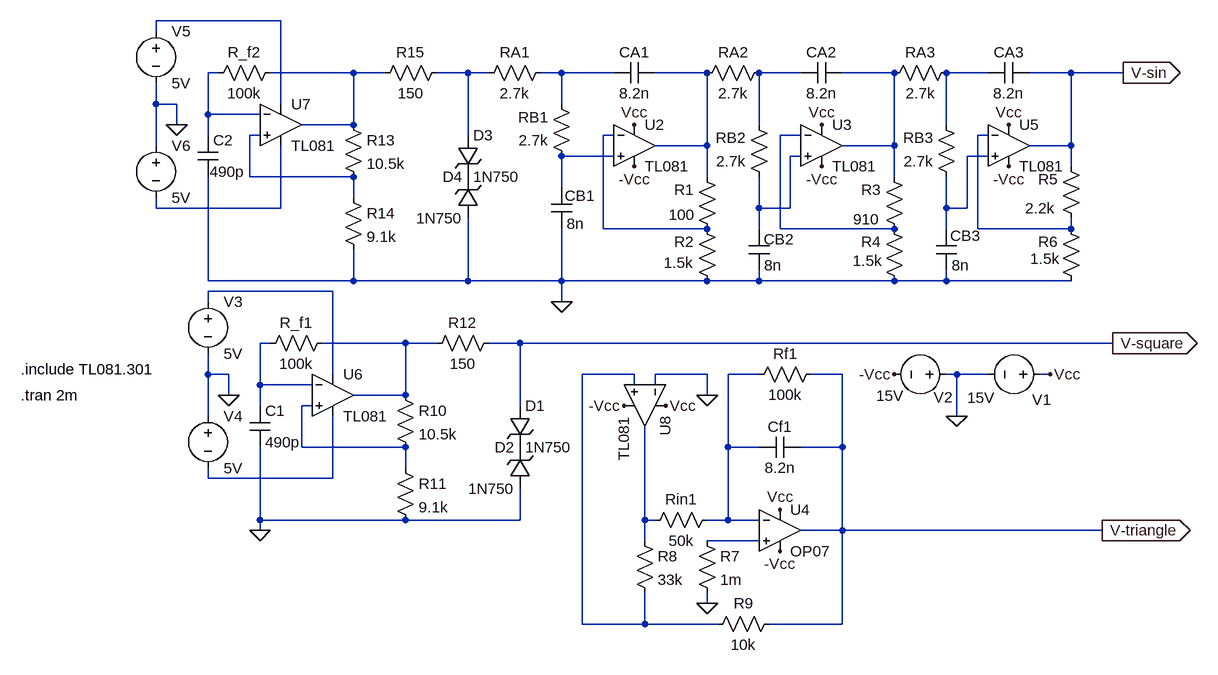
[diagram p0: schematic full circuit.asc]
full circuit.asc, the LTspice schematic file:
Version 4
SHEET 1 1568 840
WIRE -48 -288 -240 -288
WIRE -240 -272 -240 -288
WIRE -144 -208 -160 -208
WIRE 64 -208 -64 -208
WIRE 112 -208 64 -208
WIRE 240 -208 192 -208
WIRE 272 -208 240 -208
WIRE 384 -208 352 -208
WIRE 464 -208 384 -208
WIRE 608 -208 528 -208
WIRE 752 -208 688 -208
WIRE 896 -208 816 -208
WIRE 1040 -208 976 -208
WIRE 1168 -208 1104 -208
WIRE 1248 -208 1168 -208
WIRE -240 -160 -240 -192
WIRE -208 -160 -240 -160
WIRE -48 -160 -48 -288
WIRE 384 -160 384 -208
WIRE -160 -144 -160 -208
WIRE -80 -144 -160 -144
WIRE -208 -128 -208 -160
WIRE 64 -128 64 -208
WIRE 64 -128 -16 -128
WIRE 688 -128 688 -208
WIRE 976 -128 976 -208
WIRE -160 -112 -160 -144
WIRE -80 -112 -96 -112
WIRE 240 -112 240 -208
WIRE 464 -112 448 -112
WIRE 752 -112 720 -112
WIRE 1040 -112 1024 -112
WIRE -240 -96 -240 -160
WIRE 608 -96 608 -208
WIRE 608 -96 528 -96
WIRE 896 -96 896 -208
WIRE 896 -96 816 -96
WIRE 1168 -96 1168 -208
WIRE 1168 -96 1104 -96
WIRE 464 -80 384 -80
WIRE 752 -80 736 -80
WIRE 1040 -80 1008 -80
WIRE 1168 -64 1168 -96
WIRE -96 -48 -96 -112
WIRE 64 -48 -96 -48
WIRE 608 -48 608 -96
WIRE 896 -48 896 -96
WIRE 384 -32 384 -80
WIRE 64 -16 64 -48
WIRE -240 0 -240 -16
WIRE -48 0 -48 -96
WIRE -48 0 -240 0
WIRE 688 0 688 -48
WIRE 736 0 736 -80
WIRE 736 0 688 0
WIRE 976 0 976 -48
WIRE 1008 0 1008 -80
WIRE 1008 0 976 0
WIRE 448 32 448 -112
WIRE 608 32 448 32
WIRE 688 32 688 0
WIRE 720 32 720 -112
WIRE 896 32 720 32
WIRE 976 32 976 0
WIRE 1024 32 1024 -112
WIRE 1168 32 1168 16
WIRE 1168 32 1024 32
WIRE -160 112 -160 -48
WIRE 64 112 64 64
WIRE 64 112 -160 112
WIRE 240 112 240 16
WIRE 240 112 64 112
WIRE 384 112 384 32
WIRE 384 112 240 112
WIRE 608 112 384 112
WIRE 688 112 688 96
WIRE 688 112 608 112
WIRE 896 112 688 112
WIRE 976 112 976 96
WIRE 976 112 896 112
WIRE 1168 112 976 112
WIRE 32 128 -160 128
WIRE -160 144 -160 128
WIRE 384 144 384 112
WIRE -64 208 -80 208
WIRE 144 208 16 208
WIRE 192 208 144 208
WIRE 320 208 272 208
WIRE 1232 208 320 208
WIRE -160 256 -160 224
WIRE -128 256 -160 256
WIRE 32 256 32 128
WIRE 496 256 416 256
WIRE 608 256 528 256
WIRE 688 256 640 256
WIRE 816 256 768 256
WIRE 992 256 976 256
WIRE 1040 256 992 256
WIRE 1136 256 1120 256
WIRE -80 272 -80 208
WIRE 0 272 -80 272
WIRE 496 272 496 256
WIRE 528 272 528 256
WIRE -128 288 -128 256
WIRE 144 288 144 208
WIRE 144 288 64 288
WIRE 608 288 608 256
WIRE -80 304 -80 272
WIRE 0 304 -16 304
WIRE 320 304 320 208
WIRE -160 320 -160 256
WIRE 992 320 992 256
WIRE -16 368 -16 304
WIRE 144 368 -16 368
WIRE 640 368 640 256
WIRE 688 368 640 368
WIRE 816 368 816 256
WIRE 816 368 752 368
WIRE 144 400 144 368
WIRE -160 416 -160 400
WIRE 32 416 32 320
WIRE 32 416 -160 416
WIRE -80 480 -80 368
WIRE 144 480 -80 480
WIRE 320 480 320 432
WIRE 320 480 144 480
WIRE 512 480 512 336
WIRE 528 480 512 480
WIRE 640 480 640 368
WIRE 640 480 608 480
WIRE 688 480 640 480
WIRE -80 496 -80 480
WIRE 816 496 816 368
WIRE 816 496 752 496
WIRE 1216 496 816 496
WIRE 512 512 512 480
WIRE 688 512 608 512
WIRE 608 608 608 592
WIRE 416 640 416 256
WIRE 512 640 512 592
WIRE 512 640 416 640
WIRE 624 640 512 640
WIRE 816 640 816 496
WIRE 816 640 704 640
FLAG 1136 256 Vcc
FLAG 896 256 -Vcc
FLAG 496 -64 -Vcc
FLAG 784 -64 -Vcc
FLAG 1072 -64 -Vcc
FLAG 496 -128 Vcc
FLAG 784 -128 Vcc
FLAG 1072 -128 Vcc
FLAG 992 320 0
FLAG 608 608 0
FLAG 720 464 Vcc
FLAG 720 528 -Vcc
FLAG 544 304 Vcc
FLAG 480 304 -Vcc
FLAG 608 288 0
FLAG -80 496 0
FLAG -128 288 0
FLAG 1248 -208 V-sin
IOPIN 1248 -208 Out
FLAG 1232 208 V-square
IOPIN 1232 208 Out
FLAG 1216 496 V-triangle
IOPIN 1216 496 Out
FLAG -208 -128 0
FLAG 384 144 0
SYMBOL voltage 1136 256 R90
WINDOW 123 0 0 Left 0
WINDOW 39 0 0 Left 0
WINDOW 0 39 -1 VRight 2
WINDOW 3 36 85 VRight 2
SYMATTR InstName V1
SYMATTR Value 15V
SYMBOL voltage 992 256 R90
WINDOW 123 0 0 Left 0
WINDOW 39 0 0 Left 0
WINDOW 0 35 6 VRight 2
WINDOW 3 33 81 VRight 2
SYMATTR InstName V2
SYMATTR Value 15V
SYMBOL res 400 -64 R180
WINDOW 0 36 76 Left 2
WINDOW 3 36 40 Left 2
SYMATTR InstName RB1
SYMATTR Value 2.7k
SYMBOL res 368 -224 R90
WINDOW 0 0 56 VBottom 2
WINDOW 3 32 56 VTop 2
SYMATTR InstName RA1
SYMATTR Value 2.7k
SYMBOL res 624 48 R180
WINDOW 0 36 76 Left 2
WINDOW 3 35 38 Left 2
SYMATTR InstName R1
SYMATTR Value 100
SYMBOL res 624 128 R180
WINDOW 0 36 76 Left 2
WINDOW 3 37 44 Left 2
SYMATTR InstName R2
SYMATTR Value 1.5k
SYMBOL cap 368 -32 R0
WINDOW 0 21 13 Left 2
SYMATTR InstName CB1
SYMATTR Value 8n
SYMBOL cap 528 -224 R90
WINDOW 0 0 32 VBottom 2
WINDOW 3 32 32 VTop 2
SYMATTR InstName CA1
SYMATTR Value 8.2n
SYMBOL res 704 -32 R180
WINDOW 0 36 76 Left 2
WINDOW 3 36 40 Left 2
SYMATTR InstName RB2
SYMATTR Value 2.7k
SYMBOL res 704 -224 R90
WINDOW 0 0 56 VBottom 2
WINDOW 3 32 56 VTop 2
SYMATTR InstName RA2
SYMATTR Value 2.7k
SYMBOL res 912 48 R180
WINDOW 0 36 76 Left 2
WINDOW 3 39 31 Left 2
SYMATTR InstName R3
SYMATTR Value 910
SYMBOL res 912 128 R180
WINDOW 0 36 76 Left 2
WINDOW 3 34 47 Left 2
SYMATTR InstName R4
SYMATTR Value 1.5k
SYMBOL cap 672 32 R0
WINDOW 0 23 16 Left 2
SYMATTR InstName CB2
SYMATTR Value 8n
SYMBOL cap 816 -224 R90
WINDOW 0 0 32 VBottom 2
WINDOW 3 32 32 VTop 2
SYMATTR InstName CA2
SYMATTR Value 8.2n
SYMBOL res 992 -32 R180
WINDOW 0 36 76 Left 2
WINDOW 3 36 40 Left 2
SYMATTR InstName RB3
SYMATTR Value 2.7k
SYMBOL res 1184 32 R180
WINDOW 0 36 76 Left 2
WINDOW 3 41 32 Left 2
SYMATTR InstName R5
SYMATTR Value 2.2k
SYMBOL res 1184 128 R180
WINDOW 0 36 76 Left 2
WINDOW 3 33 50 Left 2
SYMATTR InstName R6
SYMATTR Value 1.5k
SYMBOL cap 960 32 R0
WINDOW 0 22 11 Left 2
SYMATTR InstName CB3
SYMATTR Value 8n
SYMBOL cap 1104 -224 R90
WINDOW 0 0 32 VBottom 2
WINDOW 3 32 32 VTop 2
SYMATTR InstName CA3
SYMATTR Value 8.2n
SYMBOL res 992 -224 R90
WINDOW 0 0 56 VBottom 2
WINDOW 3 32 56 VTop 2
SYMATTR InstName RA3
SYMATTR Value 2.7k
SYMBOL Opamps\\OP07 720 432 R0
SYMATTR InstName U4
SYMBOL cap 752 352 R90
WINDOW 0 0 32 VBottom 2
WINDOW 3 32 32 VTop 2
SYMATTR InstName Cf1
SYMATTR Value 8.2n
SYMBOL res 624 464 R90
WINDOW 0 0 56 VBottom 2
WINDOW 3 32 56 VTop 2
SYMATTR InstName Rin1
SYMATTR Value 50k
SYMBOL res 784 240 R90
WINDOW 0 0 56 VBottom 2
WINDOW 3 32 56 VTop 2
SYMATTR InstName Rf1
SYMATTR Value 100k
SYMBOL res 592 496 R0
SYMATTR InstName R7
SYMATTR Value 1m
SYMBOL res 496 496 R0
SYMATTR InstName R8
SYMATTR Value 33k
SYMBOL res 720 624 R90
WINDOW 0 0 56 VBottom 2
WINDOW 3 32 56 VTop 2
SYMATTR InstName R9
SYMATTR Value 10k
SYMBOL res 32 192 R90
WINDOW 0 0 56 VBottom 2
WINDOW 3 32 56 VTop 2
SYMATTR InstName R_f1
SYMATTR Value 100k
SYMBOL res 128 272 R0
SYMATTR InstName R10
SYMATTR Value 10.5k
SYMBOL res 128 384 R0
SYMATTR InstName R11
SYMATTR Value 9.1k
SYMBOL cap -96 304 R0
SYMATTR InstName C1
SYMATTR Value 490p
SYMBOL OpAmps\\opamp2 32 224 R0
SYMATTR InstName U6
SYMATTR Value TL081
SYMBOL voltage -160 128 R0
WINDOW 123 0 0 Left 0
WINDOW 39 0 0 Left 0
SYMATTR InstName V3
SYMATTR Value 5V
SYMBOL voltage -160 304 R0
WINDOW 123 0 0 Left 0
WINDOW 39 0 0 Left 0
SYMATTR InstName V4
SYMATTR Value 5V
SYMBOL res 176 224 R270
WINDOW 0 32 56 VTop 2
WINDOW 3 0 56 VBottom 2
SYMATTR InstName R12
SYMATTR Value 150
SYMBOL zener 304 304 R0
SYMATTR InstName D1
SYMATTR Value 1N750
SYMBOL zener 336 432 R180
WINDOW 0 24 64 Left 2
WINDOW 3 24 0 Left 2
SYMATTR InstName D2
SYMATTR Value 1N750
SYMBOL res -48 -224 R90
WINDOW 0 0 56 VBottom 2
WINDOW 3 32 56 VTop 2
SYMATTR InstName R_f2
SYMATTR Value 100k
SYMBOL res 48 -144 R0
SYMATTR InstName R13
SYMATTR Value 10.5k
SYMBOL res 48 -32 R0
SYMATTR InstName R14
SYMATTR Value 9.1k
SYMBOL cap -176 -112 R0
WINDOW 3 19 56 Left 2
SYMATTR Value 490p
SYMATTR InstName C2
SYMBOL OpAmps\\opamp2 -48 -192 R0
SYMATTR InstName U7
SYMATTR Value TL081
SYMBOL voltage -240 -288 R0
WINDOW 123 0 0 Left 0
WINDOW 39 0 0 Left 0
SYMATTR InstName V5
SYMATTR Value 5V
SYMBOL voltage -240 -112 R0
WINDOW 123 0 0 Left 0
WINDOW 39 0 0 Left 0
SYMATTR InstName V6
SYMATTR Value 5V
SYMBOL res 96 -192 R270
WINDOW 0 32 56 VTop 2
WINDOW 3 0 56 VBottom 2
SYMATTR InstName R15
SYMATTR Value 150
SYMBOL zener 224 -112 R0
SYMATTR InstName D3
SYMATTR Value 1N750
SYMBOL zener 256 16 R180
WINDOW 0 24 64 Left 2
WINDOW 3 24 0 Left 2
SYMATTR InstName D4
SYMATTR Value 1N750
SYMBOL OpAmps\\opamp2 496 -160 R0
SYMATTR InstName U2
SYMATTR Value TL081
SYMBOL OpAmps\\opamp2 784 -160 R0
SYMATTR InstName U3
SYMATTR Value TL081
SYMBOL OpAmps\\opamp2 1072 -160 R0
SYMATTR InstName U5
SYMATTR Value TL081
SYMBOL OpAmps\\opamp2 576 304 R90
SYMATTR InstName U8
SYMATTR Value TL081
TEXT -448 288 Left 2 !.tran 2m
TEXT -448 248 Left 2 !.include TL081.301

The netlist it stands for:
* full circuit.asc
V1 Vcc 0 15V
V2 0 -Vcc 15V
RB1 N014 N005 2.7k
RA1 N005 N004 2.7k
R1 N011 N006 100
R2 0 N011 1.5k
CB1 N014 0 8n
CA1 N006 N005 8.2n
RB2 N015 N007 2.7k
RA2 N007 N006 2.7k
R3 N012 N008 910
R4 0 N012 1.5k
CB2 N015 0 8n
CA2 N008 N007 8.2n
RB3 N016 N009 2.7k
R5 N013 V-sin 2.2k
R6 0 N013 1.5k
CB3 N016 0 8n
CA3 V-sin N009 8.2n
RA3 N009 N008 2.7k
XU4 N026 N022 Vcc -Vcc V-triangle LT1001  ; OP07, pins In+ In- V+ V- OUT
Cf1 V-triangle N022 8.2n
Rin1 N022 N025 50k
Rf1 V-triangle N022 100k
R7 N026 0 1m
R8 N025 N021 33k
R9 V-triangle N021 10k
R_f1 N020 N019 100k
R10 N020 N023 10.5k
R11 N023 0 9.1k
C1 N019 0 490p
XU6 N023 N019 N018 N024 N020 TL081  ; pins In+ In- V+ V- OUT
V3 N018 0 5V
V4 0 N024 5V
R12 N020 V-square 150
D1 V-square P001 1N750
D2 0 P001 1N750
R_f2 N003 N002 100k
R13 N003 N010 10.5k
R14 N010 0 9.1k
C2 N002 0 490p
XU7 N010 N002 N001 N017 N003 TL081  ; pins In+ In- V+ V- OUT
V5 N001 0 5V
V6 0 N017 5V
R15 N003 N004 150
D3 N004 P002 1N750
D4 0 P002 1N750
XU2 N014 N011 Vcc -Vcc N006 TL081  ; pins In+ In- V+ V- OUT
XU3 N015 N012 Vcc -Vcc N008 TL081  ; pins In+ In- V+ V- OUT
XU5 N016 N013 Vcc -Vcc V-sin TL081  ; pins In+ In- V+ V- OUT
XU8 N021 0 Vcc -Vcc N025 TL081  ; pins In+ In- V+ V- OUT
.model D D
.lib standard.dio
.tran 2m
.include TL081.301
.lib LTC.lib
.backanno
.end